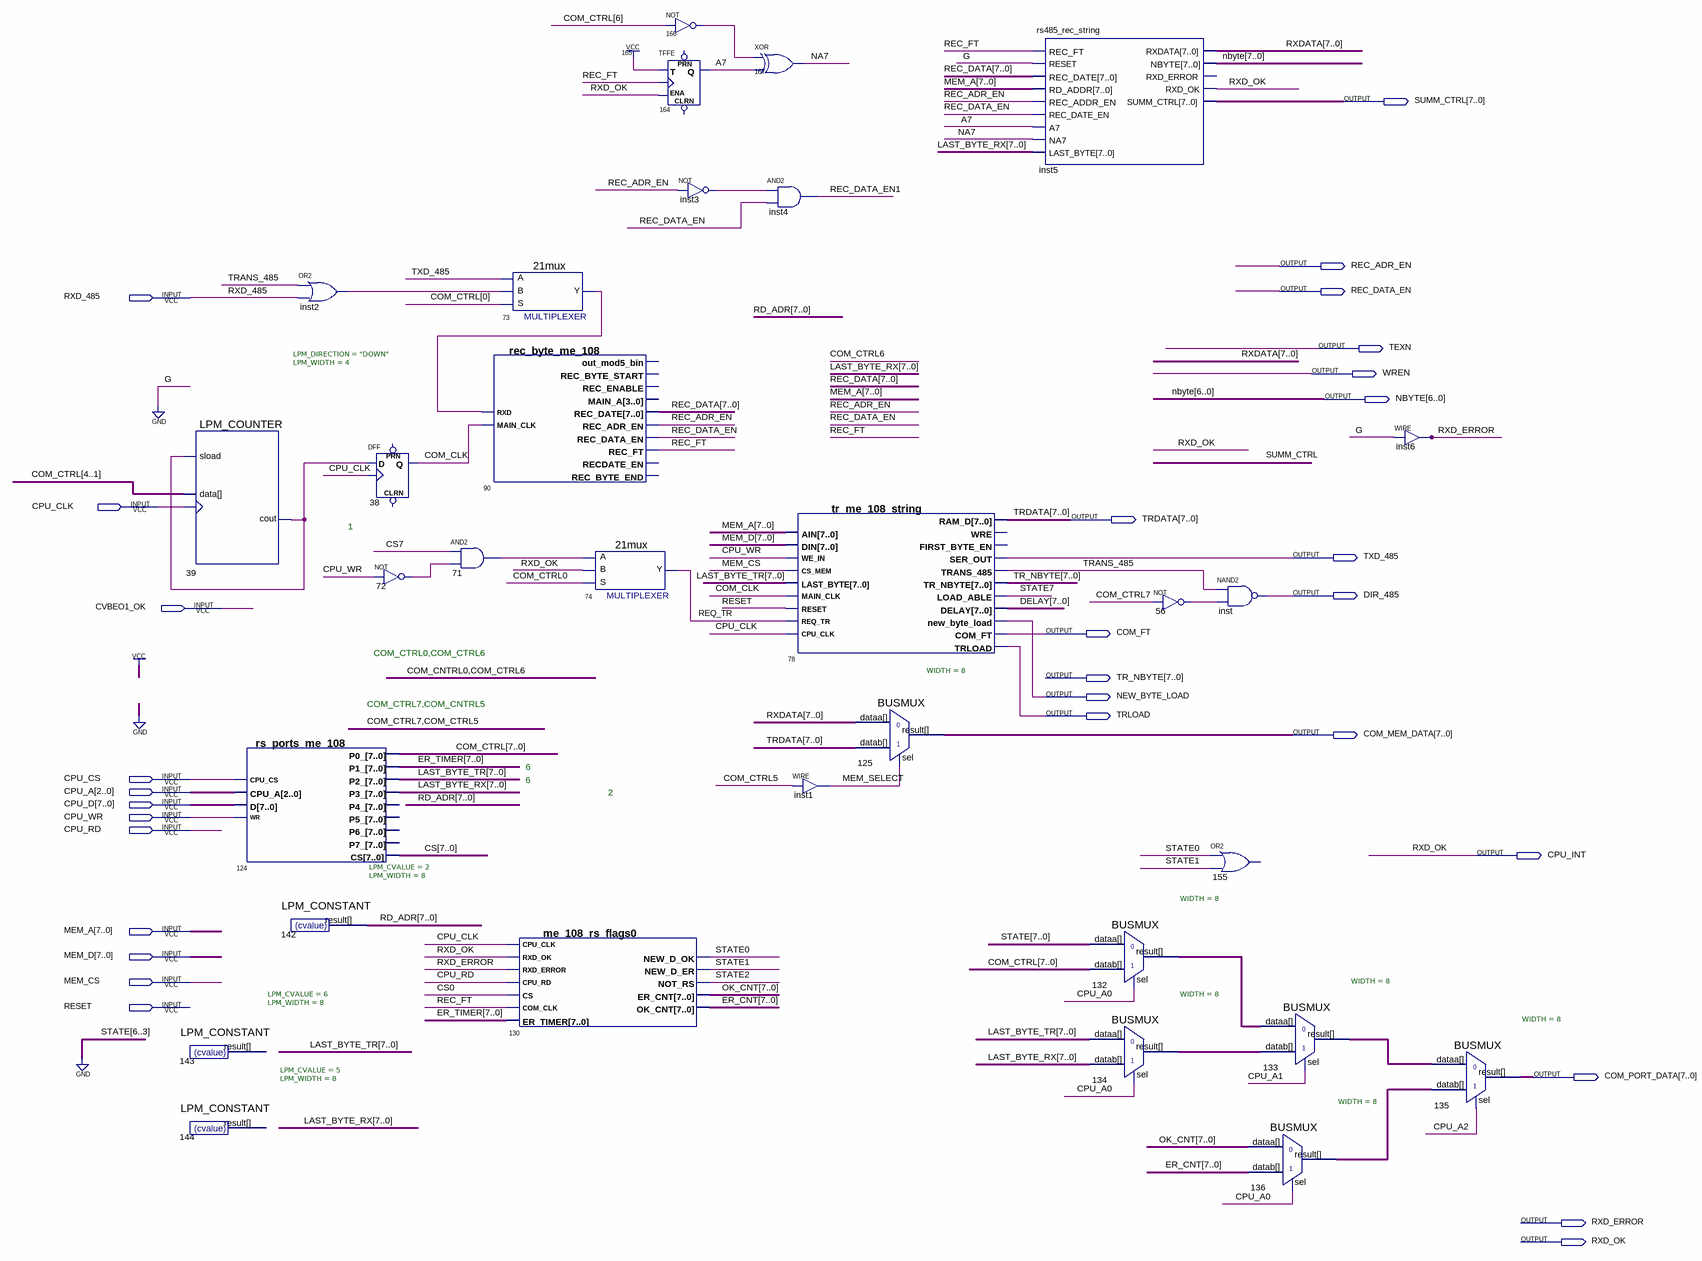
[diagram p0: schematic sheet]
// Quartus schematic me_108_rs485_top_all.bdf as structural Verilog: 31 symbols, 30 pins
module me_108_rs485_top_all (
  input  RXD_485,
  input  CPU_CLK,
  input  CVBEO1_OK,
  input  CPU_CS,
  input  [2:0] CPU_A,
  input  [7:0] CPU_D,
  input  CPU_WR,
  input  CPU_RD,
  input  [7:0] MEM_A,
  input  [7:0] MEM_D,
  input  MEM_CS,
  input  RESET,
  output [7:0] SUMM_CTRL,
  output REC_ADR_EN,
  output REC_DATA_EN,
  output TEXN,
  output WREN,
  output [7:0] NBYTE,
  output [7:0] TRDATA,
  output TXD_485,
  output DIR_485,
  output COM_FT,
  output [7:0] TR_NBYTE,
  output NEW_BYTE_LOAD,
  output TRLOAD,
  output [7:0] COM_MEM_DATA,
  output CPU_INT,
  output [7:0] COM_PORT_DATA,
  output RXD_ERROR,
  output RXD_OK
);

  wire A7, COM_CLK, inst2_out, inst3_out, MEM_SELECT, n39_cout, n56_out, n71_out, n72_out, n73_y, n166_out,
       NA7, REC_DATA_EN1, REC_FT, REQ_TR, TRANS_485;
  wire [7:0] COM_CTRL, CS, DELAY, ER_CNT, ER_TIMER, LAST_BYTE_RX, LAST_BYTE_TR, n132_result, n133_result,
       n134_result, n136_result, OK_CNT, RD_ADR, REC_DATA, RXDATA, STATE;

  LPM_COUNTER #(.LPM_DIRECTION("DOWN"), .LPM_WIDTH(4)) u_39 (
    .sload(n39_cout), .data(COM_CTRL[4:1]), .clock(CPU_CLK), .cout(n39_cout));
  LPM_CONSTANT #(.LPM_CVALUE(6), .LPM_WIDTH(8)) u_143 ();  // open: result
  LPM_CONSTANT #(.LPM_CVALUE(5), .LPM_WIDTH(8)) u_144 ();  // open: result
  rs_ports_me_108 u_124 (
    .CPU_CS(CPU_CS), .CPU_A(CPU_A), .D(CPU_D), .WR(CPU_WR), .P0_(COM_CTRL), .P1_(ER_TIMER),
    .P2_(LAST_BYTE_TR), .P3_(LAST_BYTE_RX), .CS(CS));  // open: P4_, P5_, P6_, P7_
  or inst2 (inst2_out, TRANS_485, RXD_485);
  LPM_CONSTANT #(.LPM_CVALUE(2), .LPM_WIDTH(8)) u_142 (.result(RD_ADR));
  DFF u_38 (.CLK(CPU_CLK), .D(n39_cout), .Q(COM_CLK));  // open: CLRN, PRN
  not u_72 (n72_out, CPU_WR);
  and u_71 (n71_out, CS[7], n72_out);
  \21mux  u_73 (.S(COM_CTRL[0]), .B(inst2_out), .A(TXD_485), .Y(n73_y));
  rec_byte_me_108 u_90 (
    .RXD(n73_y), .MAIN_CLK(COM_CLK), .REC_DATE(REC_DATA), .REC_ADR_EN(REC_ADR_EN), .REC_DATA_EN(REC_DATA_EN),
    .REC_FT(REC_FT));  // open: out_mod5_bin, REC_BYTE_START, REC_ENABLE, MAIN_A, RECDATE_EN, REC_BYTE_END
  me_108_rs_flags0 u_130 (
    .CPU_CLK(CPU_CLK), .RXD_OK(CPU_INT), .RXD_ERROR(RXD_ERROR), .CPU_RD(CPU_RD), .CS(CS[0]),
    .COM_CLK(REC_FT), .ER_TIMER(ER_TIMER), .NEW_D_OK(STATE[0]), .NEW_D_ER(STATE[1]), .NOT_RS(STATE[2]),
    .ER_CNT(OK_CNT), .OK_CNT(ER_CNT));
  \21mux  u_74 (.S(COM_CTRL[0]), .B(CPU_INT), .A(n71_out), .Y(REQ_TR));
  TFFE u_164 (.T(1'b1), .CLK(REC_FT), .ENA(CPU_INT), .Q(A7));  // open: CLRN, PRN
  not u_166 (n166_out, COM_CTRL[6]);
  not inst3 (inst3_out, REC_ADR_EN);
  xor u_167 (NA7, n166_out, A7);
  and inst4 (REC_DATA_EN1, inst3_out, REC_DATA_EN);
  tr_me_108_string u_78 (
    .AIN(MEM_A), .DIN(MEM_D), .WE_IN(CPU_WR), .CS_MEM(MEM_CS), .LAST_BYTE(LAST_BYTE_TR), .MAIN_CLK(COM_CLK),
    .RESET(RESET), .REQ_TR(REQ_TR), .CPU_CLK(CPU_CLK), .RAM_D(TRDATA), .SER_OUT(TXD_485),
    .TRANS_485(TRANS_485), .TR_NBYTE(TR_NBYTE), .LOAD_ABLE(STATE[7]), .DELAY(DELAY),
    .new_byte_load(NEW_BYTE_LOAD), .COM_FT(COM_FT), .TRLOAD(TRLOAD));  // open: WRE, FIRST_BYTE_EN
  assign MEM_SELECT = COM_CTRL[5];  // WIRE inst1
  BUSMUX #(.WIDTH(8)) u_125 (.datab(TRDATA), .sel(MEM_SELECT), .dataa(RXDATA), .result(COM_MEM_DATA));
  rs485_rec_string inst5 (
    .REC_FT(REC_FT), .RESET(1'b0), .REC_DATE(REC_DATA), .RD_ADDR(MEM_A), .REC_ADDR_EN(REC_ADR_EN),
    .REC_DATE_EN(REC_DATA_EN), .A7(A7), .NA7(NA7), .LAST_BYTE(LAST_BYTE_RX), .RXDATA(RXDATA), .NBYTE(NBYTE),
    .RXD_OK(CPU_INT), .SUMM_CTRL(SUMM_CTRL));  // open: RXD_ERROR
  BUSMUX #(.WIDTH(8)) u_132 (
    .datab(COM_CTRL), .sel(CPU_A[0]), .dataa({STATE[7], 4'b0000, STATE[2:0]}), .result(n132_result));
  BUSMUX #(.WIDTH(8)) u_134 (.datab(LAST_BYTE_RX), .sel(CPU_A[0]), .dataa(LAST_BYTE_TR), .result(n134_result));
  not u_56 (n56_out, COM_CTRL[7]);
  nand inst (DIR_485, TRANS_485, n56_out);
  // OR2 155 has open pins: IN1=STATE[0], IN2=STATE[1], OUT=open
  BUSMUX #(.WIDTH(8)) u_133 (.datab(n134_result), .sel(CPU_A[1]), .dataa(n132_result), .result(n133_result));
  BUSMUX #(.WIDTH(8)) u_136 (.datab(ER_CNT), .sel(CPU_A[0]), .dataa(OK_CNT), .result(n136_result));
  assign RXD_ERROR = 1'b0;  // WIRE inst6
  BUSMUX #(.WIDTH(8)) u_135 (.datab(n136_result), .sel(CPU_A[2]), .dataa(n133_result), .result(COM_PORT_DATA));

  assign RXD_OK = CPU_INT;

  // Notes on the sheet:
  //   1
  //   COM_CTRL0,COM_CTRL6
  //   COM_CTRL7,COM_CNTRL5
  //   6
  //   6
  //   2
endmodule
